# EAGLE design DetectorHardware (EAGLE 9.3.0)
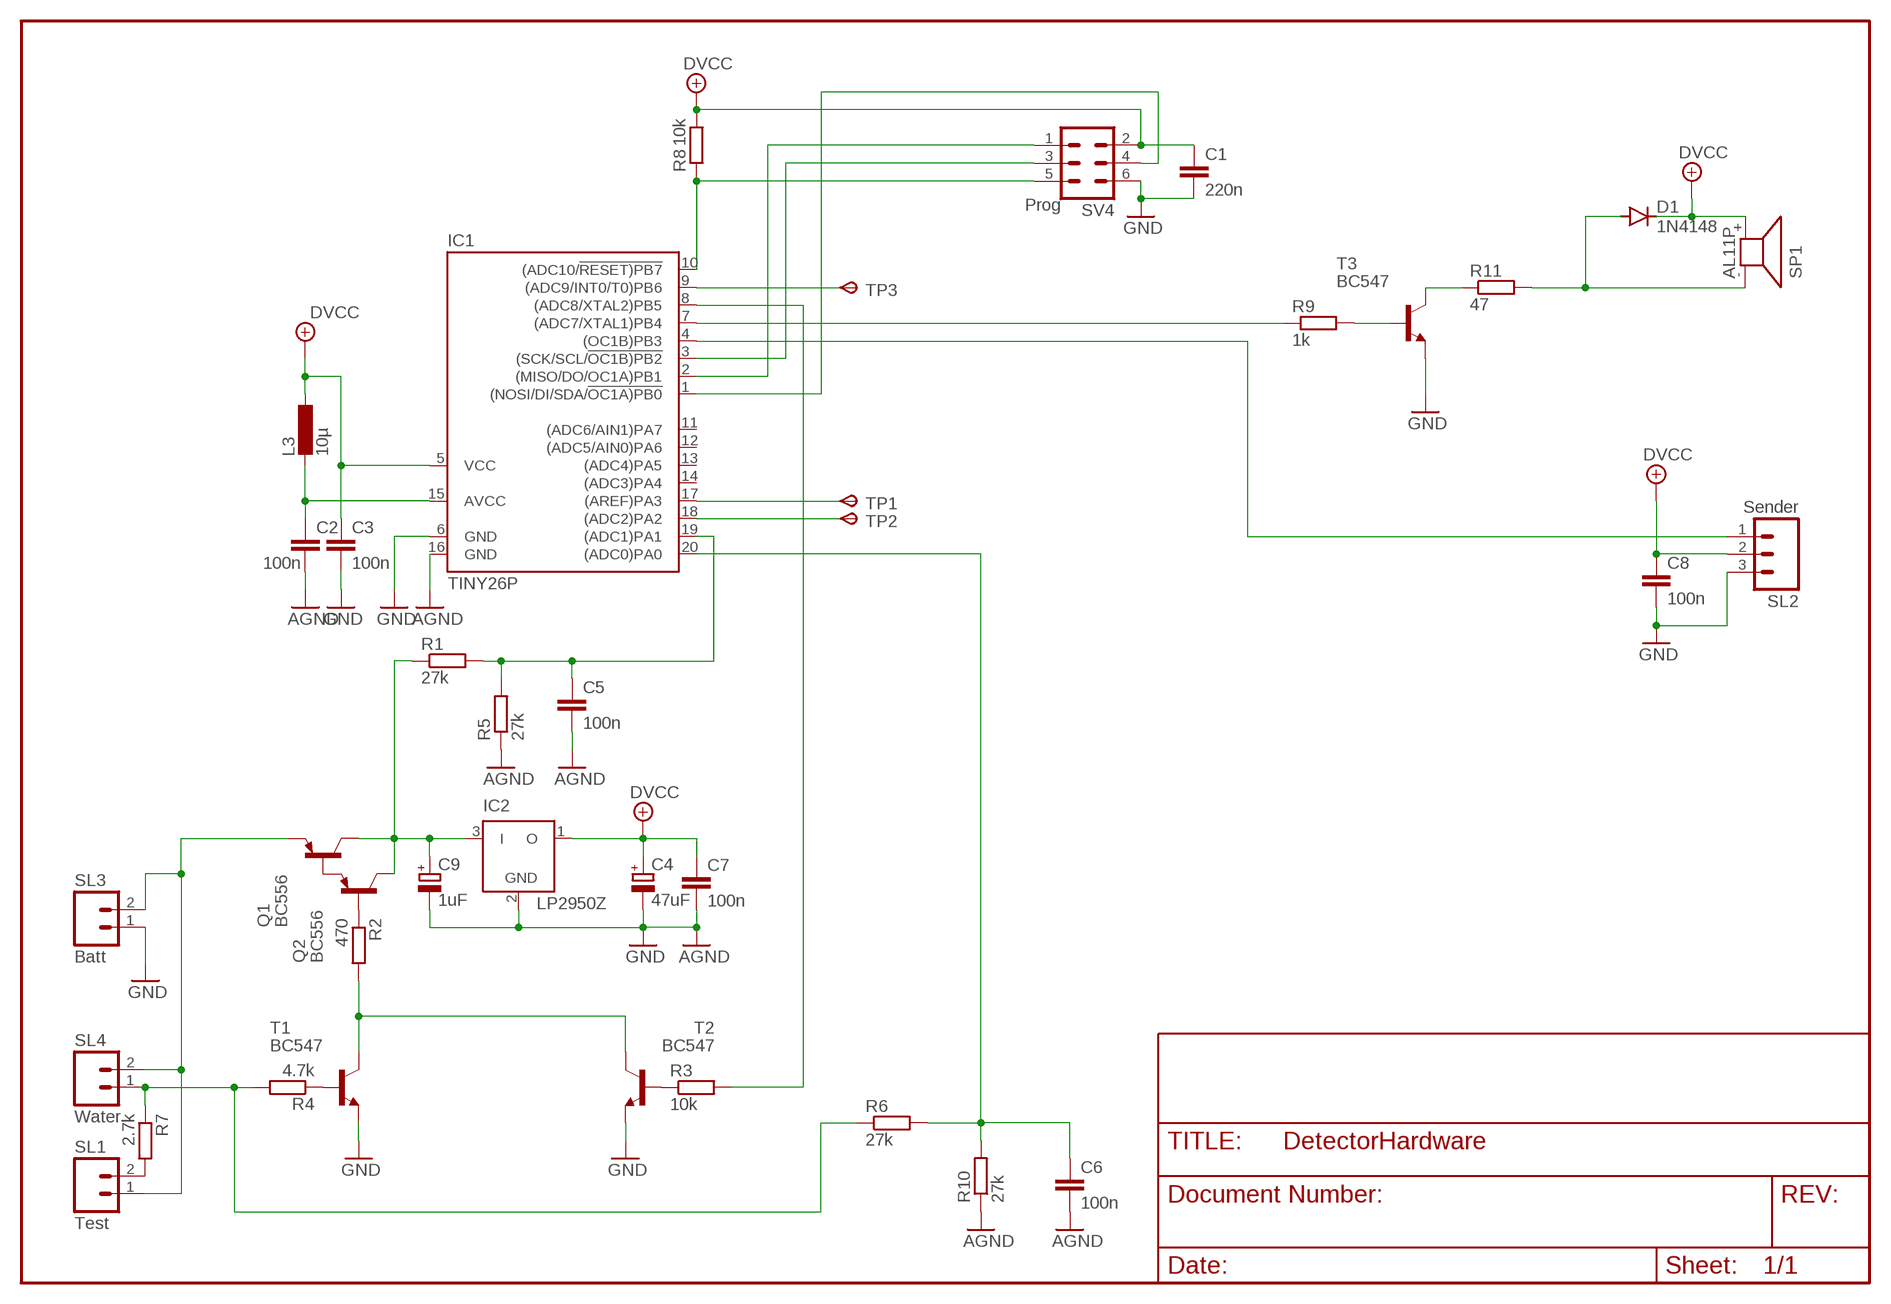
[diagram p0: schematic, sheet 1]

## Parts
C1  220n  C-EU025-024X044  [C025-024X044]
C2  100n  C-EU025-024X044  [C025-024X044]
C3  100n  C-EU025-024X044  [C025-024X044]
C4  47uF  CPOL-EUE2.5-6  [E2,5-6]
C5  100n  C-EU025-024X044  [C025-024X044]
C6  100n  C-EU025-024X044  [C025-024X044]
C7  100n  C-EU025-024X044  [C025-024X044]
C8  100n  C-EU025-024X044  [C025-024X044]
C9  1uF  CPOL-EUE2.5-6  [E2,5-6]
D1  1N4148  DIODE-D-5  [D-5]
IC1  TINY26P  [DIL20]
IC2  LP2950Z  [TO92]
L3  10µ  L-EU0204/5  [0204/5]
Q1  BC556  [TO92-EBC]
Q2  BC556  [TO92-EBC]
R1  27k  R-EU_0204/5  [0204/5]
R2  470  R-EU_0204/5  [0204/5]
R3  10k  R-EU_0204/5  [0204/5]
R4  4.7k  R-EU_0204/5  [0204/5]
R5  27k  R-EU_0204/5  [0204/5]
R6  27k  R-EU_0204/5  [0204/5]
R7  2.7k  R-EU_0204/5  [0204/5]
R8  10k  R-EU_0204/5  [0204/5]
R9  1k  R-EU_0204/5  [0204/5]
R10  27k  R-EU_0204/5  [0204/5]
R11  47  R-EU_0204/5  [0204/5]
SL1  Test  M02  [02P]
SL2  Sender  M03  [03P]
SL3  Batt  M02  [02P]
SL4  Water  M02  [02P]
SP1  AL11P  [AL11P]
SV4  Prog  MA03-2  [MA03-2]
T1  BC547  [TO92]
T2  BC547  [TO92]
T3  BC547  [TO92]
TP1  TPSB1,27  [B1,27]
TP2  TPSB1,27  [B1,27]
TP3  TPSB1,27  [B1,27]

## Nets
+5V: C1.1 C3.1 C4.+ C7.1 C8.1 D1.C IC1.5(VCC) IC2.1(O) L3.1 R8.2 SL2.2 SP1.+ SV4.2 ; supply symbol labelled DVCC
GND: C1.2 C2.2 C3.2 C4.- C5.2 C6.2 C7.2 C8.2 C9.- IC1.6(GND) IC1.16(GND) IC2.2(GND) R5.1 R10.1 SL2.3 SL3.1 SV4.6 T1.1(E) T2.1(E) T3.1(E) ; supply symbol labelled AGND
N$1: IC1.17((AREF)PA3) TP1.TP(PP)
N$2: R7.2 SL1.2
N$3: C5.1 IC1.19((ADC1)PA1) R1.2 R5.2
N$4: C2.1 IC1.15(AVCC) L3.2
N$5: R9.2 T3.2(B)
N$6: R4.1 T1.2(B)
N$7: Q1.B Q2.E
N$8: R2.2 T1.3(C) T2.3(C)
N$9: R3.1 T2.2(B)
N$10: C6.1 IC1.20((ADC0)PA0) R6.2 R10.2
N$11: IC1.8((ADC8/XTAL2)PB5) R3.2
N$12: IC1.18((ADC2)PA2) TP2.TP(PP)
N$14: R4.2 R6.1 R7.1 SL4.1
N$15: IC1.2((MISO/DO/OC1A)PB1) SV4.1
N$16: Q1.E SL1.1 SL3.2 SL4.2
N$17: D1.A R11.2 SP1.-
N$18: IC1.4((OC1B)PB3) SL2.1
N$19: IC1.7((ADC7/XTAL1)PB4) R9.1
N$21: IC1.10((ADC10/!RESET)PB7) R8.1 SV4.5
N$22: IC1.3((SCK/SCL/!OC1B)PB2) SV4.3
N$23: IC1.1((NOSI/DI/SDA/!OC1A)PB0) SV4.4
N$26: IC1.9((ADC9/INT0/T0)PB6) TP3.TP(PP)
N$27: C9.+ IC2.3(I) Q1.C Q2.C R1.1
N$28: Q2.B R2.1
N$29: R11.1 T3.3(C)
Unconnected: IC1.11((ADC6/AIN1)PA7) IC1.12((ADC5/AIN0)PA6) IC1.13((ADC4)PA5) IC1.14((ADC3)PA4)

## Library data of the parts
C1-C3 C5-C8 = rcl:C-EU: CAPACITOR, European symbol
C4 C9 = rcl:CPOL-EU: POLARIZED CAPACITOR, European symbol; SPICEPREFIX: C
D1 = diode:DIODE-: DIODE
IC1 = atmel:TINY26*: 8-bit AVR Microcontroller with 2K Bytes Flash Source: http://www.atmel.com .. doc1477.pdf
IC2 = linear:LP2950: 100 mA, Low Power Low Dropout Voltage Regulator Source: http://www.onsemi.com/pub/Collateral/LP2950-D.PDF
L3 = rcl:L-EU: INDUCTOR, European symbol
Q1 Q2 = transistor-pnp:BC556*: PNP Transistror
R1-R11 = rcl:R-EU_: RESISTOR, European symbol
SL1 SL3 SL4 = con-amp-quick:M02: AMP QUICK CONNECTOR
SL2 = con-amp-quick:M03: AMP QUICK CONNECTOR
SP1 = buzzer:AL11P: SPEAKER Source: Buerklin; OC_FARNELL: unknown; OC_NEWARK: unknown
SV4 = con-lstb:MA03-2: PIN HEADER
T1-T3 = transistor:BC547: NPN TRANSISTOR
TP1-TP3 = testpad:TPS: TEST PIN

## Board
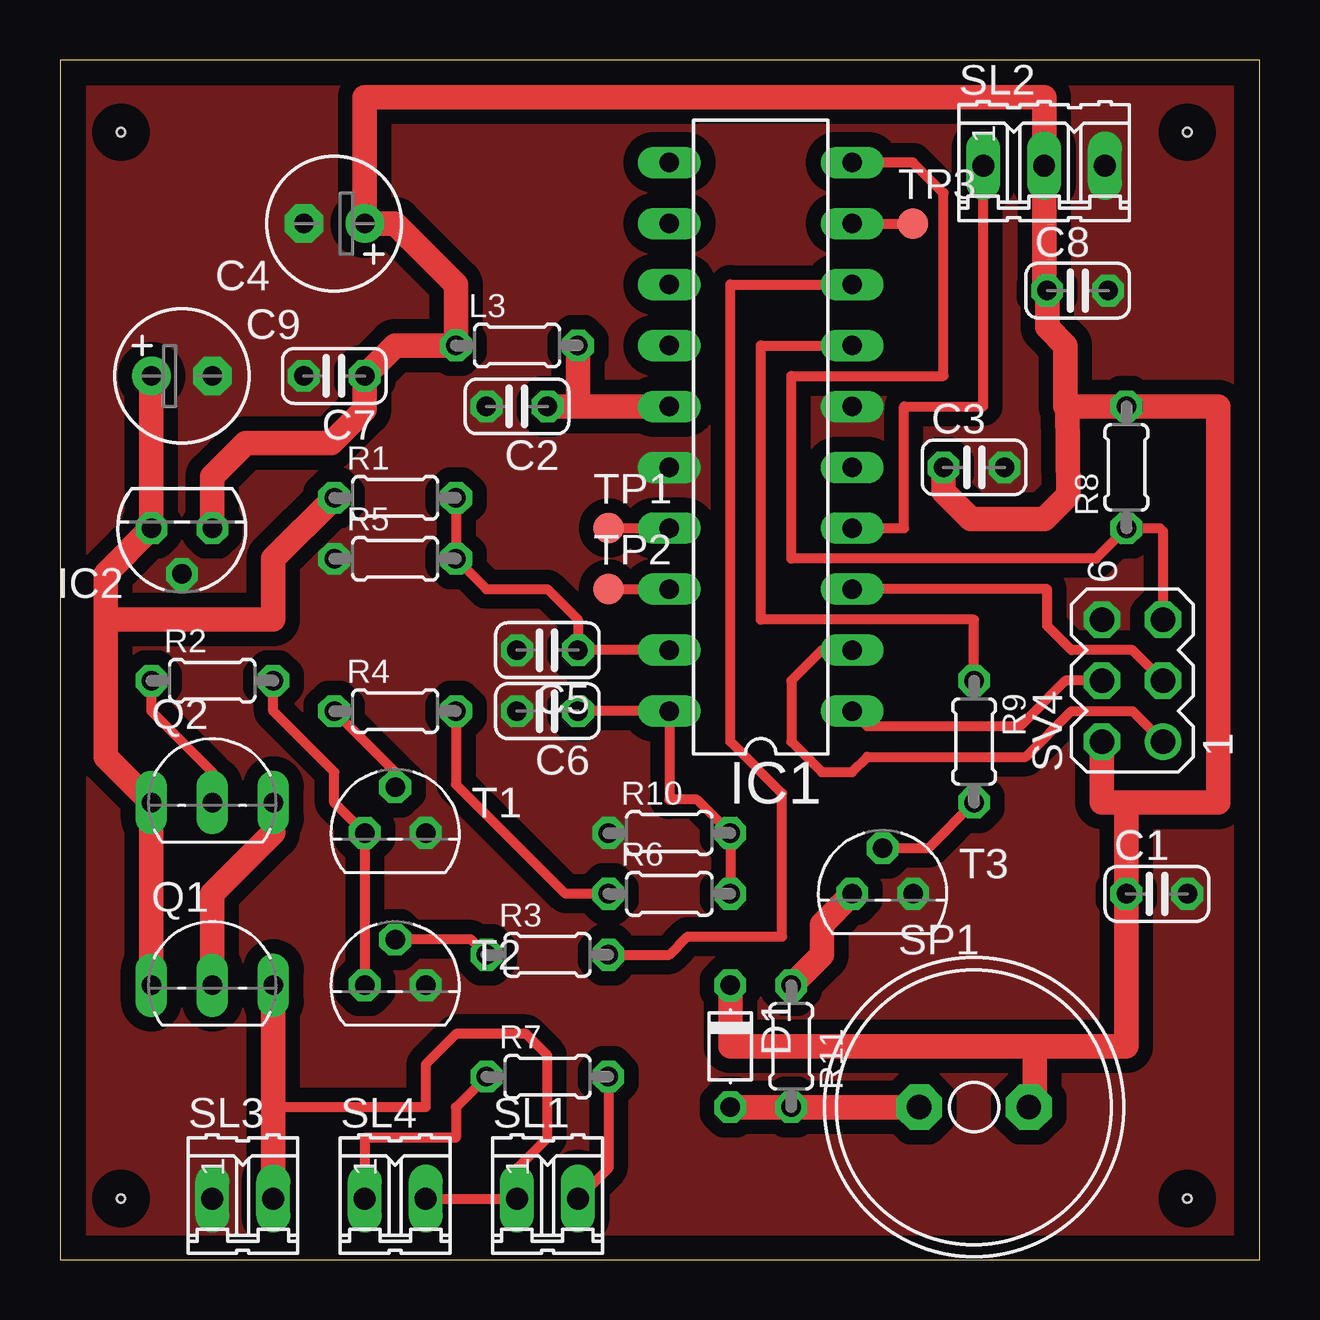
[diagram p1: board, top side]
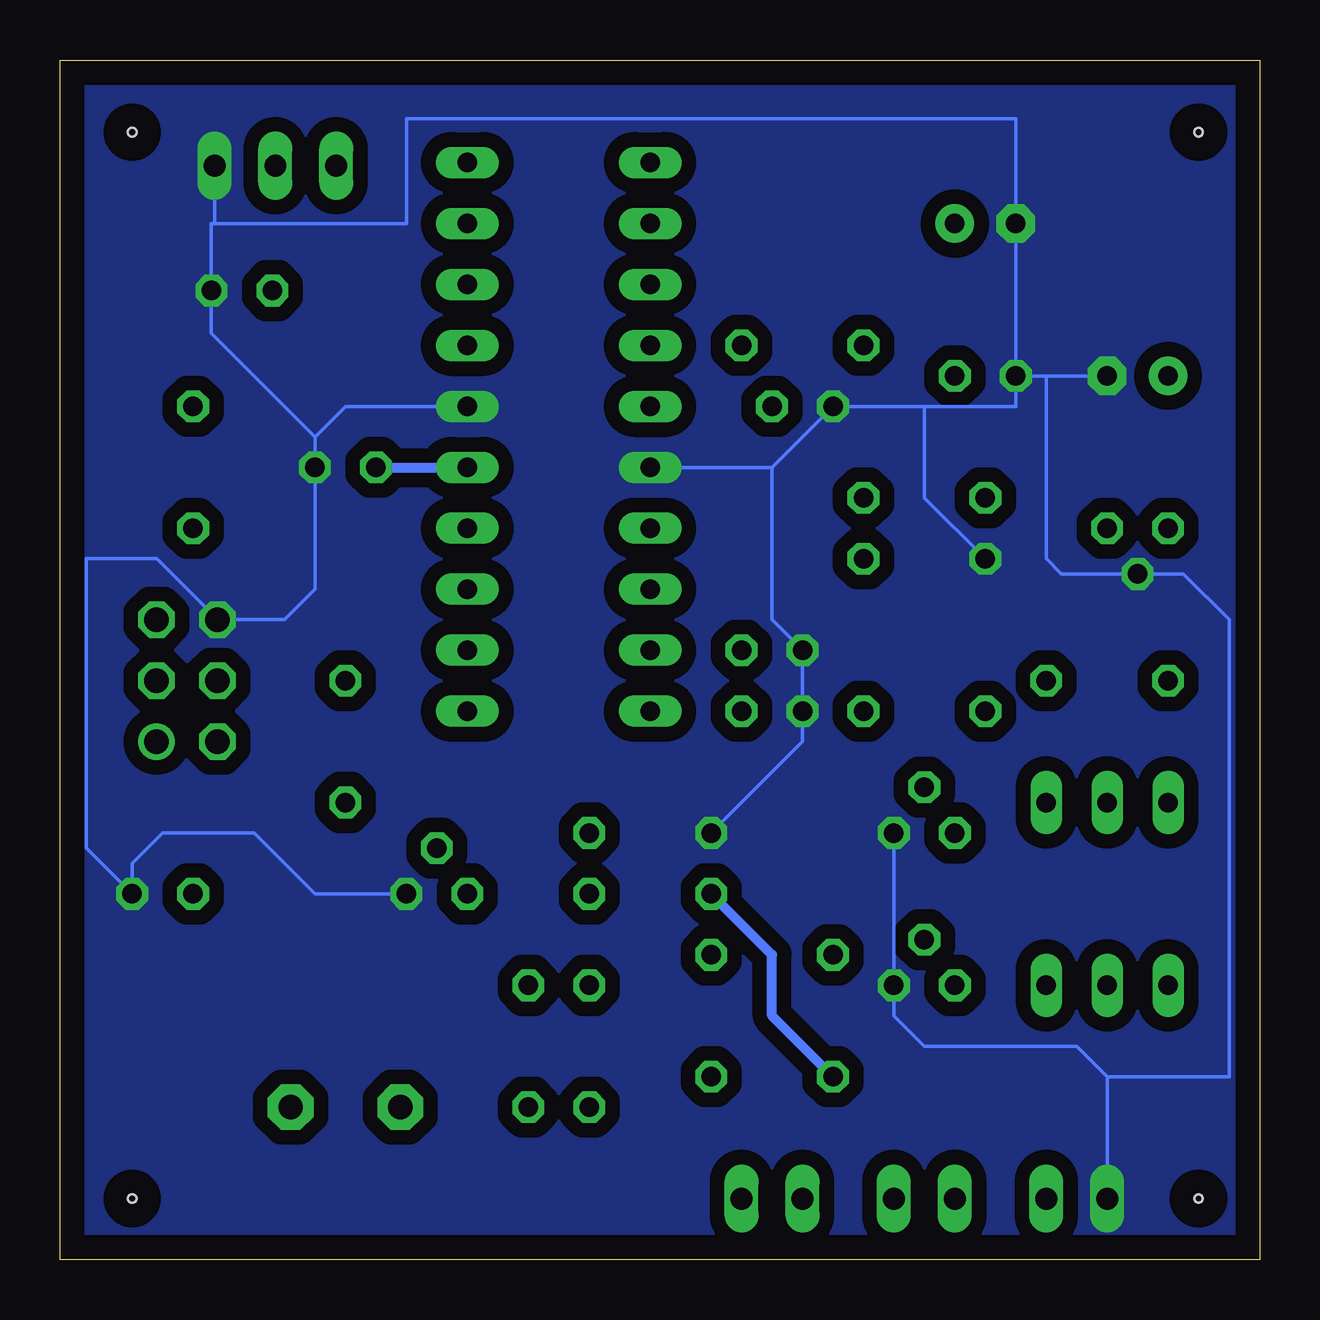
[diagram p2: board, bottom side, seen from below]

Size 50 x 50 mm. Coordinates in mm from the lower left corner, seen from the top.
Outline: 0,0 50,0 50,50 0,50 0,0
Copper layers (1*16): Top 0.035mm / dielectric 1.5mm / Bottom 0.035mm
Design rules "default": minimum track width 6mil, minimum drill 0.35mm, track to track 6mil, track to pad 6mil, pad to pad 6mil, via to via 6mil, smd to smd 6mil, copper to edge 40mil, drill to drill 6mil, minimum pad ring 10mil, minimum via ring 8mil, stop-mask expansion 4mil, vias tented up to drill 0mil, thermal gap 10mil
Holes 0.35 mm at 2.54,46.99 2.54,2.54 46.99,2.54 46.99,46.99

### Footprints (pad centres in the part's own frame; a part is rotated, then mirrored left to right if it is on the bottom)
C025-024X044 = drill 0.813 octagon: 1 -1.27,0; 2 1.27,0
E2,5-6 = drill 0.813 pad 1.6: + -1.27,0 | drill 0.813 pad 1.6 octagon: - 1.27,0
D-5 = drill 0.813 octagon: A 2.54,0; C -2.54,0
DIL20 = drill 0.813 long: 1 -11.43,-3.81; 2 -8.89,-3.81; 3 -6.35,-3.81; 4 -3.81,-3.81; 5 -1.27,-3.81; 6 1.27,-3.81; 7 3.81,-3.81; 8 6.35,-3.81; 9 8.89,-3.81; 10 11.43,-3.81; 11 11.43,3.81; 12 8.89,3.81; 13 6.35,3.81; 14 3.81,3.81; 15 1.27,3.81; 16 -1.27,3.81; 17 -3.81,3.81; 18 -6.35,3.81; 19 -8.89,3.81; 20 -11.43,3.81
TO92 = drill 0.813 octagon: 1 -1.27,0; 2 0,1.905; 3 1.27,0
0204/5 = drill 0.813 octagon: 1 -2.54,0; 2 2.54,0
TO92-EBC = drill 0.813 long: B 0,-1.27; C -2.54,-1.27; E 2.54,-1.27
02P = drill 0.914 long: 1 -1.27,0; 2 1.27,0
03P = drill 0.914 long: 1 -2.54,0; 2 0,0; 3 2.54,0
AL11P = drill 1.016 pad 1.905 octagon: + 2.286,0; - -2.286,0
MA03-2 = drill 1.016: 1 -2.54,-1.27 | drill 1.016 octagon: 2 -2.54,1.27; 3 0,-1.27; 4 0,1.27; 5 2.54,-1.27; 6 2.54,1.27
TO92' = drill 0.813 octagon: 1 1.27,0; 2 0,1.905; 3 -1.27,0
B1,27 = smd 1.27 x 1.27: TP 0,0

### Placement (x,y rotation side)
C1  45.72,15.24 0 top
C2  19.05,35.56 180 top
C3  38.1,33.02 0 top
C4  11.43,43.18 180 top
C5  20.32,25.4 180 top
C6  20.32,22.86 180 top
C7  11.43,36.83 180 top
C8  42.42,40.39 0 top
C9  5.08,36.83 0 top
D1  27.94,8.89 270 top
IC1  29.21,34.29 90 top
IC2  5.08,30.48 180 top
L3  19.05,38.1 0 top
Q1  6.35,12.7 0 top
Q2  6.35,20.32 0 top
R1  13.97,31.75 0 top
R2  6.35,24.13 0 top
R3  20.32,12.7 0 top
R4  13.97,22.86 0 top
R5  13.97,29.21 0 top
R6  25.4,15.24 0 top
R7  20.32,7.62 0 top
R8  44.45,33.02 90 top
R9  38.1,21.59 270 top
R10  25.4,17.78 0 top
R11  30.48,8.89 270 top
SL1  20.32,2.54 0 top
SL2  41.02,45.59 0 top
SL3  7.62,2.54 0 top
SL4  13.97,2.54 0 top
SP1  38.1,6.35 0 top
SV4  44.7,24.13 90 top
T1  BC547  [TO92']  13.97,17.78 0 top
T2  BC547  [TO92']  13.97,11.43 0 top
T3  BC547  [TO92']  34.29,15.24 0 top
TP1  22.86,30.48 0 top
TP2  22.86,27.94 0 top
TP3  35.56,43.18 0 top

### Tracks (layer width: path | path; a pad name or v marks a point on that pad's centre or on a via)
+5V
  Top 0.152: 41.02,40.51 C8.1 | R8.2 41.99,35.56 | 48.27,35.55 48.26,35.56
  Top 1.016: D1.C 27.94,8.89 40.64,8.89 | 41.02,40.51 SL2.2 41.02,48.45 12.7,48.45 C4.+ 13.97,43.18 16.51,40.64 L3.1 13.97,38.1 C7.1 12.7,35.43 11.3,34.04 7.75,34.04 6.35,32.64 IC2.1 | C8.1 41.15,38.86 41.91,38.1 41.91,35.56 R8.2 48.26,35.56 | 41.99,35.56 42.03,31.87 41.02,30.86 37.97,30.86 36.83,32 C3.1 | SV4.2 43.43,19.05 44.45,19.05 | 44.45,19.05 C1.1 44.45,8.89 40.64,8.89 | 44.45,19.05 48.27,19.05 48.27,35.55 | SP1.+ 40.64,6.6 40.64,8.89
  Bottom 0.406: C3.1 IC1.5
GND
  Bottom 0.152: 20.32,33.02 C2.2 13.97,35.56 | 20.32,33.02 IC1.16 | 13.97,35.56 10.16,35.56 C7.2 | 20.32,33.02 20.32,26.67 C5.2 C6.2 19.05,21.59 R10.1 | R5.1 13.97,31.75 13.97,35.56 | C7.2 C4.- 10.16,47.56 35.56,47.56 35.56,43.18 43.56,43.18 | C7.2 8.89,36.83 | 8.89,36.83 C9.- | SL3.1 6.35,7.62 | 6.35,7.62 7.62,8.89 13.97,8.89 15.24,10.16 T2.1 T1.1 | 8.89,36.83 8.89,29.21 8.26,28.57 IC2.2 3.17,28.57 1.27,26.67 1.27,7.62 6.35,7.62 | IC1.6 38.1,35.56 39.37,34.29 | 39.37,34.29 C3.2 39.37,27.94 40.64,26.67 SV4.6 45.97,29.21 48.91,29.21 48.91,17.16 C1.2 46.99,16.51 45.72,17.78 41.91,17.78 39.37,15.24 T3.1 | 39.37,34.29 43.69,38.61 C8.2 43.69,43.18 43.56,43.18 | 43.56,43.18 SL2.3
  pour Bottom (isolate 0.61, no thermals): 0.38,0.25 49.66,0.25 49.66,49.66 0.38,49.66
  pour Top (isolate 0.61, no thermals): 1.14,1.02 1.14,48.9 48.9,48.9 48.9,1.02
N$1
  Top 0.406: TP1.TP IC1.17
N$2
  Top 0.406: R7.2 22.86,3.81 SL1.2
N$3
  Top 0.406: IC1.19 C5.1 21.59,26.67 20.32,27.94 17.78,27.94 R5.2 R1.2
N$4
  Top 1.016: L3.2 21.59,35.56 | 21.59,35.56 IC1.15 | 21.59,35.56 C2.1
N$5
  Top 0.406: R9.2 36.2,17.14 T3.2
N$6
  Top 0.406: R4.1 13.97,20.32 T1.2
N$7
  Top 1.016: Q2.E 8.89,17.78 6.35,15.24 Q1.B
N$8
  Top 0.406: T2.3 T1.3 11.43,19.05 11.43,20.32 8.89,22.86 R2.2
N$9
  Top 0.406: R3.1 17.14,13.34 T2.2
N$10
  Top 0.406: C6.1 IC1.20 25.4,19.18 26.54,19.18 R10.2 R6.2
N$11
  Top 0.406: R3.2 25.4,12.7 26.16,13.46 30.1,13.46 30.1,19.43 27.94,21.59 27.94,40.64 IC1.8
N$12
  Top 0.406: TP2.TP IC1.18
N$14
  Top 0.406: R7.1 16.51,6.35 16.51,5.08 12.7,5.08 SL4.1 | R6.1 21.08,15.24 16.51,19.81 R4.2
  Bottom 0.406: R7.1 20.32,10.16 20.32,12.7 R6.1
N$15
  Top 0.406: IC1.2 31.75,25.4 30.48,24.13 30.48,21.59 31.75,20.32 33.02,20.32 33.66,20.95 40.26,20.95 42.16,22.86 44.7,22.86 SV4.1
N$16
  Top 0.406: SL4.2 SL1.1 19.05,3.81 20.32,5.08 20.32,8.51 19.43,9.4 16.51,9.4 15.24,8.13 15.24,6.35 8.89,6.35
  Top 1.016: SL3.2 8.89,6.35 Q1.E
N$17
  Top 1.016: D1.A R11.2 SP1.-
N$18
  Top 0.406: IC1.4 35.18,30.48 35.18,35.56 38.48,35.56 SL2.1
N$19
  Top 0.406: R9.1 38.1,26.67 29.21,26.67 29.21,38.1 IC1.7
N$21
  Top 0.152: 45.97,30.35 45.85,30.48
  Top 0.406: 45.85,30.48 R8.1 43.18,29.21 30.48,29.21 30.48,36.83 36.83,36.83 36.83,44.45 35.56,45.72 IC1.10 | 45.97,30.35 SV4.5
N$22
  Top 0.406: SV4.3 44.7,25.4 42.16,25.4 41.15,26.42 41.15,27.94 IC1.3
N$23
  Top 0.406: SV4.4 41.91,24.13 40.01,22.23 33.66,22.23 IC1.1
N$26
  Top 0.406: IC1.9 TP3.TP
N$27
  Top 1.016: C9.+ IC2.3 1.91,28.57 1.91,26.67 | 1.91,26.67 1.91,20.95 Q2.C Q1.C | R1.1 8.89,29.21 8.89,26.67 1.91,26.67
N$28
  Top 0.406: R2.1 3.81,22.86 6.35,20.32 Q2.B
N$29
  Top 1.016: R11.1 31.75,12.7 31.75,13.97 T3.3